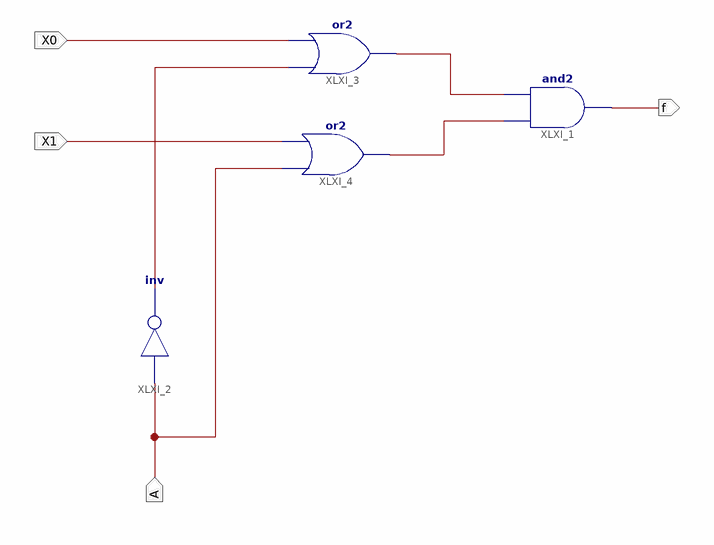
[diagram p0: schematic sheet 1]
// Xilinx ISE schematic mux4x1.sch (spartan3e) as structural Verilog: 4 symbols, 4 ports
module mux4x1 (
  input  A,
  input  X0,
  input  X1,
  output f
);

  wire XLXN_3, XLXN_7, XLXN_8;

  and XLXI_1 (f, XLXN_8, XLXN_7);
  not XLXI_2 (XLXN_3, A);
  or XLXI_3 (XLXN_7, XLXN_3, X0);
  or XLXI_4 (XLXN_8, A, X1);
endmodule
